# EAGLE design TF0060DCA (EAGLE 9.6.2)
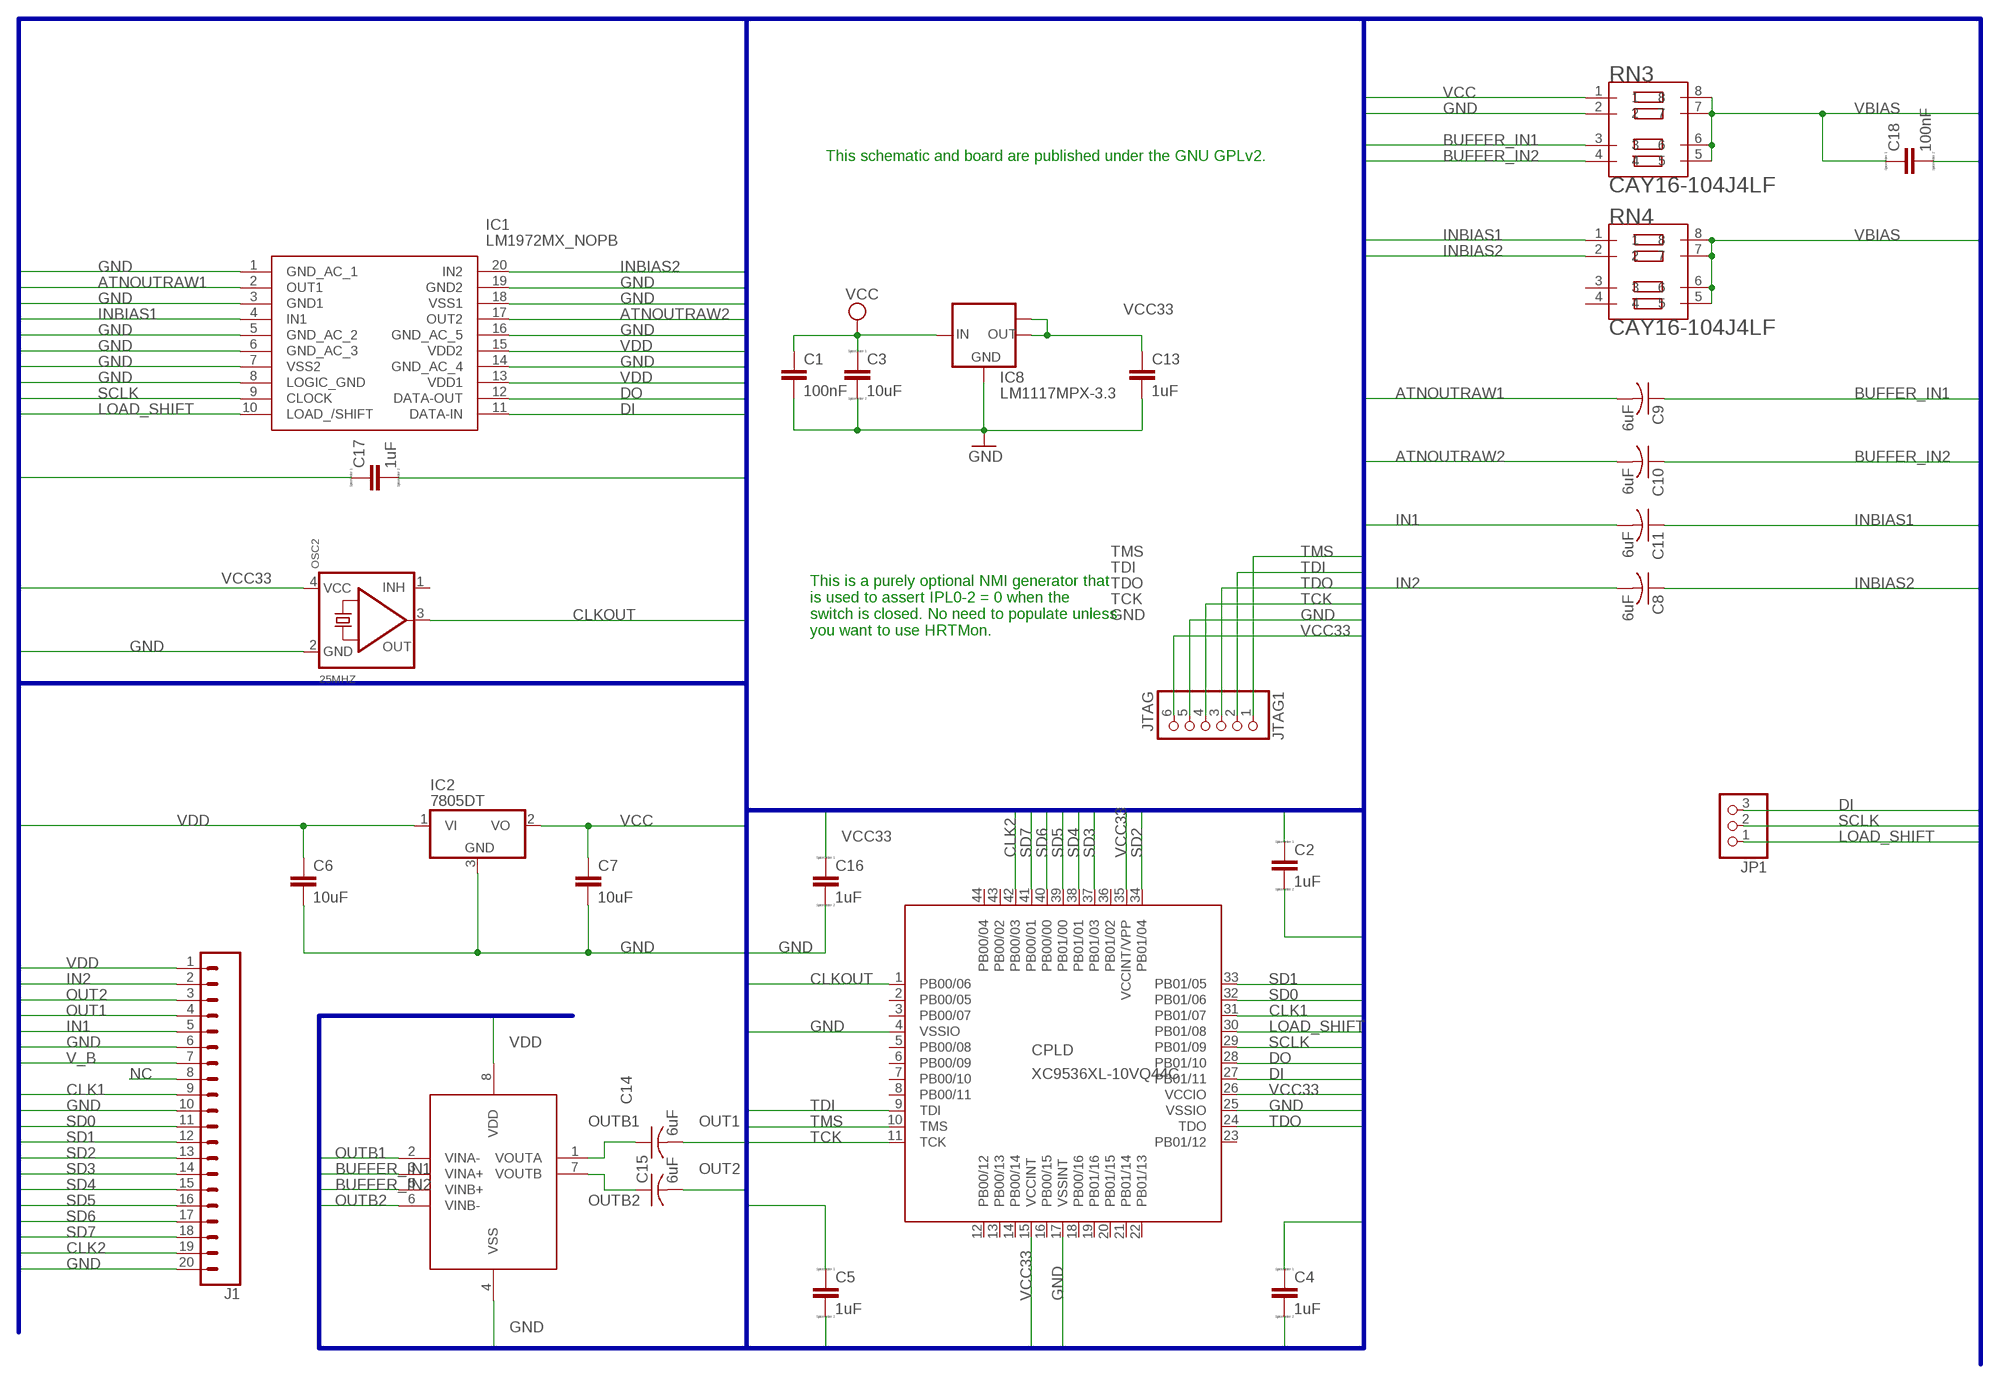
[diagram p0: schematic, sheet 1]

## Parts
C1  100nF  C-EUC1206  [C1206]
C2  1uF  CC0603  [C0603]
C3  10uF  CC0603  [C0603]
C4  1uF  CC0603  [C0603]
C5  1uF  CC0603  [C0603]
C6  10uF  C-EUC1206  [C1206]
C7  10uF  C-EUC1206  [C1206]
C8  6uF  C-USC0805  [C0805]
C9  6uF  C-USC0805  [C0805]
C10  6uF  C-USC0805  [C0805]
C11  6uF  C-USC0805  [C0805]
C13  1uF  C-EUC1206  [C1206]
C14  6uF  C-USC0805  [C0805]
C15  6uF  C-USC0805  [C0805]
C16  1uF  CC0603  [C0603]
C17  1uF  CC0603  [C0603]
C18  100nF  CC0603  [C0603]
CPLD  XC9536XL-10VQ44C  XC9536_44VQ  [SQFP-S-10X10-44]
IC1  LM1972MX_NOPB  [SOIC127P1030X265-20N]
IC2  7805DT  [TO252]
IC8  LM1117MPX-3.3  [SOT223]
IC12  MCP6002T-I_SN  [SOIC127P600X175-8N]
J1  CONN_20  [1X20]
JP1  PINHD-1X3  [1X03]
JTAG1  JTAG  HEADER-1X6ROUND  [1X06_ROUND]
OSC2  25MHZ  OSCILLATOR  [OSC_7X5MM]
RN3  CAY16-104J4LF  CAY16-103J4LF  [RESCAXE80P320X160-8N]
RN4  CAY16-104J4LF  CAY16-103J4LF  [RESCAXE80P320X160-8N]

## Nets
ATNOUTRAW1: C9.2 IC1.2(OUT1)
ATNOUTRAW2: C10.2 IC1.17(OUT2)
BUFFER_IN1: C9.1 IC12.3(VINA+) RN3.3
BUFFER_IN2: C10.1 IC12.5(VINB+) RN3.4
CLK1: CPLD.31(PB01/07) J1.9
CLK2: CPLD.42(PB00/03) J1.19
CLKOUT: CPLD.1(PB00/06) OSC2.3(OUT)
DI: CPLD.27(PB01/11) IC1.11(DATA-IN) JP1.3
DO: CPLD.28(PB01/10) IC1.12(DATA-OUT)
GND: C1.2 C2.2 C3.2 C4.2 C5.2 C6.2 C7.2 C13.2 C16.2 C17.2 C18.2 CPLD.4(VSSIO) CPLD.17(VSSINT) CPLD.25(VSSIO) IC1.1(GND_AC_1) IC1.3(GND1) IC1.5(GND_AC_2) IC1.6(GND_AC_3) IC1.7(VSS2) IC1.8(LOGIC_GND) IC1.14(GND_AC_4) IC1.16(GND_AC_5) IC1.18(VSS1) IC1.19(GND2) IC2.3(GND) IC8.1(GND) IC12.4(VSS) J1.6 J1.10 J1.20 JTAG1.5 OSC2.2(GND) RN3.2
IN1: C11.2 J1.5
IN2: C8.2 J1.2
INBIAS1: C11.1 IC1.4(IN1) RN4.1
INBIAS2: C8.1 IC1.20(IN2) RN4.2
LOAD_SHIFT: CPLD.30(PB01/08) IC1.10(LOAD_/SHIFT) JP1.1
NC: J1.8
OUT1: C14.2 J1.4
OUT2: C15.2 J1.3
OUTB1: C14.1 IC12.1(VOUTA) IC12.2(VINA-)
OUTB2: C15.1 IC12.6(VINB-) IC12.7(VOUTB)
SCLK: CPLD.29(PB01/09) IC1.9(CLOCK) JP1.2
SD0: CPLD.32(PB01/06) J1.11
SD1: CPLD.33(PB01/05) J1.12
SD2: CPLD.34(PB01/04) J1.13
SD3: CPLD.37(PB01/03) J1.14
SD4: CPLD.38(PB01/01) J1.15
SD5: CPLD.39(PB01/00) J1.16
SD6: CPLD.40(PB00/00) J1.17
SD7: CPLD.41(PB00/01) J1.18
TCK: CPLD.11(TCK) JTAG1.4
TDI: CPLD.9(TDI) JTAG1.2
TDO: CPLD.24(TDO) JTAG1.3
TMS: CPLD.10(TMS) JTAG1.1
V_B: J1.7
VBIAS: C18.1 RN3.5 RN3.6 RN3.7 RN3.8 RN4.5 RN4.6 RN4.7 RN4.8
VCC: C1.1 C3.1 C7.1 C17.1 IC2.2(VO) IC8.3(IN) RN3.1
VCC33: C2.1 C4.1 C5.1 C13.1 C16.1 CPLD.15(VCCINT) CPLD.26(VCCIO) CPLD.35(VCCINT/VPP) IC8.2(OUT) IC8.TAB(OUT1) JTAG1.6 OSC2.4(VCC)
VDD: C6.1 IC1.13(VDD1) IC1.15(VDD2) IC2.1(VI) IC12.8(VDD) J1.1
Unconnected: CPLD.2(PB00/05) CPLD.3(PB00/07) CPLD.5(PB00/08) CPLD.6(PB00/09) CPLD.7(PB00/10) CPLD.8(PB00/11) CPLD.12(PB00/12) CPLD.13(PB00/13) CPLD.14(PB00/14) CPLD.16(PB00/15) CPLD.18(PB00/16) CPLD.19(PB01/16) CPLD.20(PB01/15) CPLD.21(PB01/14) CPLD.22(PB01/13) CPLD.23(PB01/12) CPLD.36(PB01/02) CPLD.43(PB00/02) CPLD.44(PB00/04) OSC2.1(INH) RN4.3 RN4.4

## Buses
ATNOUTRAW[1..2],BUFFER_IN[1..2],CLK[1..2],CLKOUT,DI,DO,GND,IN[1..2],INBIAS[1..2],LOAD_SHIFT,OBUF[1..2],OUT[1..2],OUTB[1..2],SCLK,SD[0..7],TCK,TDI,TDO,TMS,V_B,VBIAS,VCC,VCC33,VDD

## Notes on the sheet
- This schematic and board are published under the GNU GPLv2.
- This is a purely optional NMI generator that 
  is used to assert IPL0-2 = 0 when the
  switch is closed. No need to populate unless
  you want to use HRTMon.

## Library data of the parts
C1 C6 C7 C13 = rcl:C-EU: CAPACITOR, European symbol; SPICEPREFIX: C
C2-C5 C16-C18 = eagle-ltspice:C: CAPACITOR, European symbol; SPICEMODEL: NONE; SPICEPREFIX: C
C8-C11 C14 C15 = rcl:C-US: CAPACITOR, American symbol; SPICEPREFIX: C
CPLD = xilinx-xc9:XC9536_44VQ: xc9536_pc44 XC9500 In-System Programmable CPLD Family Auto generated by make-symbol-device-package-bsdl.ulp Rev. 34 Source: xc9536_vq44.bsd; MPN: XC9536-15VQG44C; OC_FARNELL: 1193227; OC_NEWARK: 98K3377
IC1 = SamacSys_Parts:LM1972MX_NOPB: Micro-Pot 2-Channel 78 dB Audio Attenuator with Mute Source: Datasheet <http://www.ti.com/lit/gpn/LM1972>; DESCRIPTION: Micro-Pot 2-Channel 78 dB Audio Attenuator with Mute; HEIGHT: 2.65mm; MANUFACTURER_NAME: Texas Instruments; MANUFACTURER_PART_NUMBER: LM1972MX/NOPB; MOUSER_PART_NUMBER: 926-LM1972MX/NOPB; MOUSER_PRICE-STOCK: https://www.mouser.co.uk/ProductDetail/Texas-Instruments/LM1972MX-NOPB?qs=X1J7HmVL2ZH04ksznhxyxw%3D%3D
IC2 = linear:78*: Positive VOLTAGE REGULATOR Source: http://cache.national.com/ds/LM/LM78L05.pdf http://www.fairchildsemi.com/ds/LM/LM7805.pdf
IC8 = lm1117:LM1117MPX-*
IC12 = MCP6002T-I_SN:MCP6002T-I_SN: Op. Amplifier Dual 1MHz Low-Power SOIC8 Microchip MCP6002T-I/SN, Dual Low Power Op Amp, 1MHz Rail-Rail, 1.8 6 V, 8-Pin SOIC Source: Datasheet <http://uk.rs-online.com/web/p/products/8234276P>; ALLIED_NUMBER: 70451327; DESCRIPTION: Op. Amplifier Dual 1MHz Low-Power SOIC8 Microchip MCP6002T-I/SN, Dual Low Power Op Amp, 1MHz Rail-Rail, 1.8 6 V, 8-Pin SOIC; HEIGHT: 1.75mm; MANUFACTURER_NAME: Microchip; MANUFACTURER_PART_NUMBER: MCP6002T-I/SN; RS_PART_NUMBER: 8234276P; RS_PRICE-STOCK: http://uk.rs-online.com/web/p/products/8234276P
J1 = SparkFun-Connectors:CONN_20: Multi connection point. Often used as Generic Header-pin footprint for 0.1 inch spaced/style header connections On any of the 0.1 inch spaced packages, you can populate with these: Break Away Headers - Straight <https://www.sparkfun.com/products/116> (PRT-00116) Break Away Male Headers - Right Angle <https://www.sparkfun.com/products/553> (PRT-00553) Female Headers <https://www.sparkfun.com/products/115> (PRT-00115) Break Away Headers - Machine Pin <https://www.sparkfun.com/products/117> (PRT-00117) Break Away Female Headers - Swiss Machine Pin <https://www.sparkfun.com/products/743> (PRT-00743) For SCREWTERMINALS and SPRING TERMINALS visit here: Screw Terimnals on SparkFun.com <https://www.sparkfun.com/search/results?term=Screw+Terminals> (5mm/3.5mm/2.54mm spacing) This device is also useful as a general connection point to wire up your design to another part of your project. Our various solder wires solder well into these plated through hole pads. Hook-Up Wire - Assortment (Stranded, 22 AWG) <https://www.sparkfun.com/products/11375> (PRT-11375) Hook-Up Wire - Assortment (Solid Core, 22 AWG) <https://www.sparkfun.com/products/11367> (PRT-11367) View the entire wire category on our website here <https://www.sparkfun.com/categories/141> Special notes: Molex polarized connector foot print use with SKU : PRT-08231 with associated crimp pins and housings. 1MM SMD Version SKU: PRT-10208 NOTES ON THE VARIANTS LOCK and LOCK_LONGPADS... This footprint was designed to help hold the alignment of a through-hole component (i.e. 6-pin header) while soldering it into place. You may notice that each hole has been shifted either up or down by 0.005 of an inch from it's more standard position (which is a perfectly straight line). This slight alteration caused the pins (the squares in the middle) to touch the edges of the holes. Because they are alternating, it causes a "brace" to hold the component in place. 0.005 has proven to be the perfect amount of "off-center" position when using our standard breakaway headers. Although looks a little odd when you look at the bare footprint, once you have a header in there, the alteration is very hard to notice. Also,if you push a header all the way into place, it is covered up entirely on the bottom side. Note about LOCK SPECIAL package: This is just like the LOCK variant in that the holes are staggared by 5 mil, but except for the last two holes. They are not altered from the "standard" footprint layout. This is used for a special purpose on the layout of our Graphic LCD Backpack. Make sure you want to use this device before selecting it for you project!
JP1 = adafruit:PINHD-1X3: PIN HEADER
JTAG1 = microbuilder:HEADER-1X6: PIN HEADER
OSC2 = microbuilder:OSCILLATOR: Oscillators 3.2x2.5mm SMT 4.0MHz +/- 50ppm, 3.3V, 9mA, -40/+85°C - Digikey: 535-9752-1-ND 50MHz +/- 50ppm, 3.3V, 8mA, -10/+70°C - Digikey: 478-4792-1-ND 5x7mm SMT 4.0MHz +/-20ppm 3.3V, 20mA, -20/+70°C - Digikey: 535-9329-2-ND 50MHz +/- 25ppm 3.3V, 35mA, -40/+85°C - Digikey: 631-1197-1-ND
RN3 RN4 = CAY16-103J4LF:CAY16-103J4LF: Res Thick Film Array 10K Ohm 5% 200ppm/C ISOL Molded 8-Pin 1206(4 X 0603) Convex SMD Paper T/R; AVAILABILITY: Good; DESCRIPTION: Res Thick Film Array 10K Ohm 5% ?200ppm/C ISOL Molded 8-Pin 1206(4 X 0603) Convex SMD Paper T/R; MF: Bourns; MP: CAY16-103J4LF; PACKAGE: 1206 Bourns; PRICE: 0.02 USD

## Board
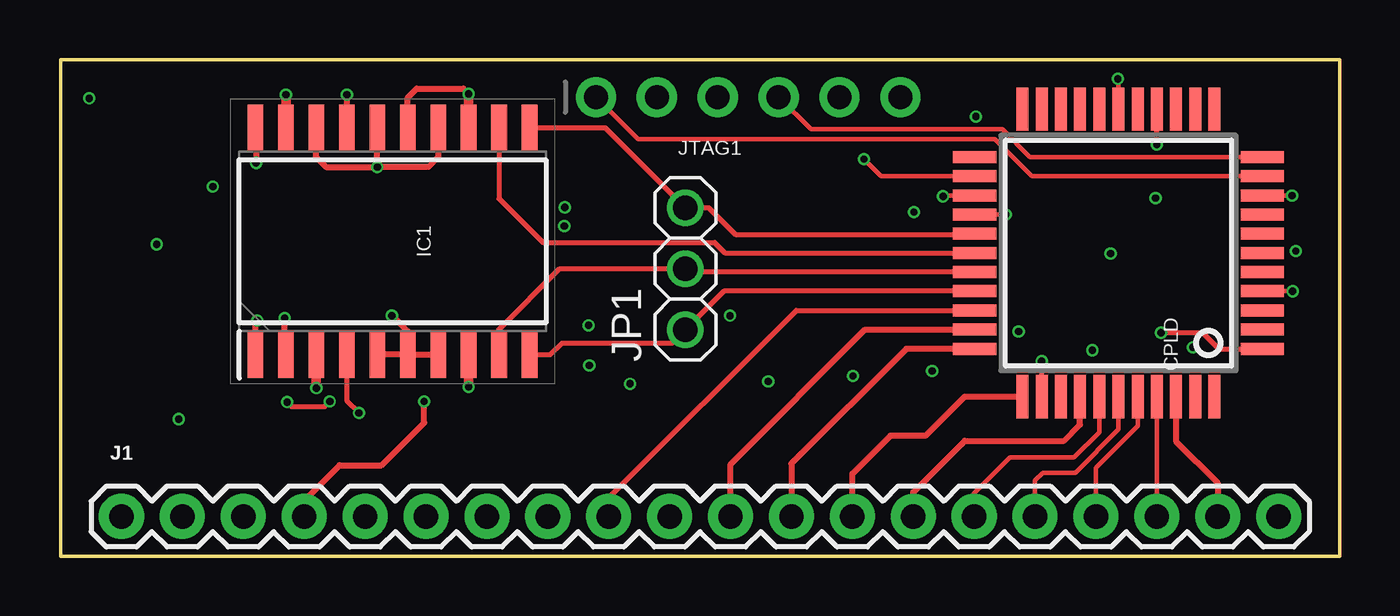
[diagram p1: board, top side]
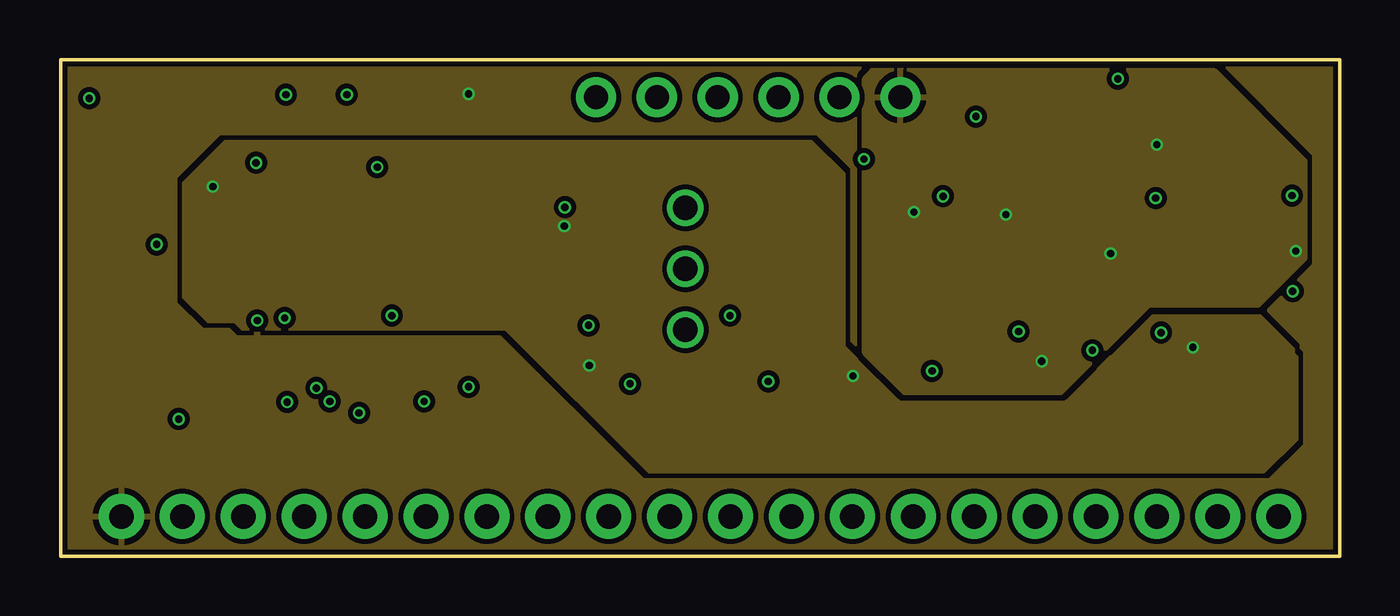
[diagram p2: board, inner layer PWR]
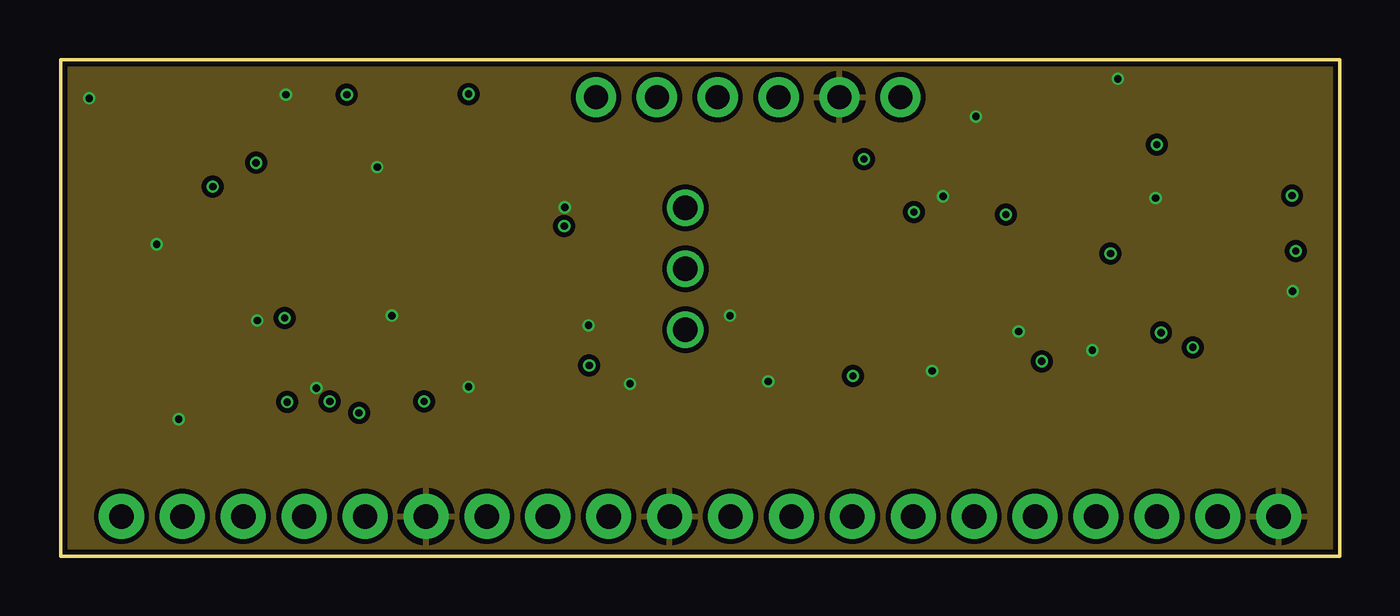
[diagram p3: board, inner layer GND]
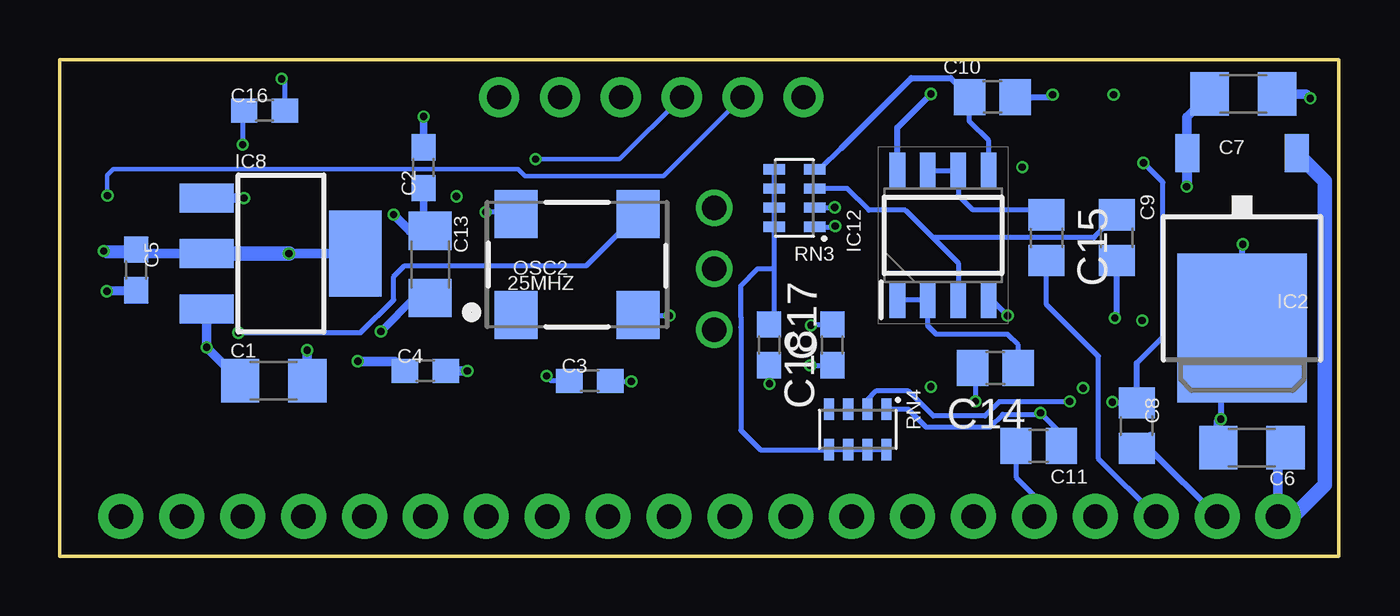
[diagram p4: board, bottom side, seen from below]

Size 53.34 x 20.7 mm. Coordinates in mm from the lower left corner, seen from the top.
Outline: 0,0 0,20.7 53.34,20.7 53.34,0 0,0
Copper layers (1*2*15*16): Top 0.035559375mm / dielectric 0.17018125mm / PWR 0.01778125mm / dielectric 47mil / GND 0.01778125mm / dielectric 0.17018125mm / Bottom 0.035559375mm
Design rules "jlcpcb-4-layer (1) *": minimum track width 5mil, minimum drill 0.2mm, track to track 0.126490625mm, track to pad 0.126490625mm, pad to pad 0.126490625mm, via to via 0.126490625mm, smd to smd 0mil, copper to edge 0.1mm, drill to drill 5mil, minimum pad ring 4mil, minimum via ring 4mil, stop-mask expansion 3mil, vias tented up to drill 100mil, thermal gap 10mil

### Footprints (pad centres in the part's own frame; a part is rotated, then mirrored left to right if it is on the bottom)
C1206 = smd 1.6 x 1.8: 1 -1.4,0; 2 1.4,0
C0603 = smd 1.1 x 1: 1 -0.85,0; 2 0.85,0
C0805 = smd 1.3 x 1.5: 1 -0.95,0; 2 0.95,0
SQFP-S-10X10-44 = smd 0.5 x 1.8: 1 -4,-6; 2 -3.2,-6; 3 -2.4,-6; 4 -1.6,-6; 5 -0.8,-6; 6 0,-6; 7 0.8,-6; 8 1.6,-6; 9 2.4,-6; 10 3.2,-6; 11 4,-6; 23 4,6; 24 3.2,6; 25 2.4,6; 26 1.6,6; 27 0.8,6; 28 0,6; 29 -0.8,6; 30 -1.6,6; 31 -2.4,6; 32 -3.2,6; 33 -4,6 | smd 1.8 x 0.5: 12 6,-4; 13 6,-3.2; 14 6,-2.4; 15 6,-1.6; 16 6,-0.8; 17 6,0; 18 6,0.8; 19 6,1.6; 20 6,2.4; 21 6,3.2; 22 6,4; 34 -6,4; 35 -6,3.2; 36 -6,2.4; 37 -6,1.6; 38 -6,0.8; 39 -6,0; 40 -6,-0.8; 41 -6,-1.6; 42 -6,-2.4; 43 -6,-3.2; 44 -6,-4
SOIC127P1030X265-20N = smd 1.95 x 0.65: 1 -4.725,5.715; 2 -4.725,4.445; 3 -4.725,3.175; 4 -4.725,1.905; 5 -4.725,0.635; 6 -4.725,-0.635; 7 -4.725,-1.905; 8 -4.725,-3.175; 9 -4.725,-4.445; 10 -4.725,-5.715; 11 4.725,-5.715; 12 4.725,-4.445; 13 4.725,-3.175; 14 4.725,-1.905; 15 4.725,-0.635; 16 4.725,0.635; 17 4.725,1.905; 18 4.725,3.175; 19 4.725,4.445; 20 4.725,5.715
TO252 = smd 1 x 1.6: 1 -2.28,-4.8; 2 2.28,-4.8 | smd 5.4 x 6.2: 3 0,2.5
SOT223 = smd 1.219 x 2.235: 1 -2.311,-3.099; 2 0,-3.099; 3 2.311,-3.099 | smd 3.6 x 2.2: TAB 0,3.099
SOIC127P600X175-8N = smd 1.5 x 0.65: 1 -2.7,1.905; 2 -2.7,0.635; 3 -2.7,-0.635; 4 -2.7,-1.905; 5 2.7,-1.905; 6 2.7,-0.635; 7 2.7,0.635; 8 2.7,1.905
1X20 = drill 1.016 pad 1.88: 1 0,0; 2 2.54,0; 3 5.08,0; 4 7.62,0; 5 10.16,0; 6 12.7,0; 7 15.24,0; 8 17.78,0; 9 20.32,0; 10 22.86,0; 11 25.4,0; 12 27.94,0; 13 30.48,0; 14 33.02,0; 15 35.56,0; 16 38.1,0; 17 40.64,0; 18 43.18,0; 19 45.72,0; 20 48.26,0
1X03 = drill 1.016: 1 -2.54,0; 2 0,0; 3 2.54,0
1X06_ROUND = drill 1 pad 1.676: 1 -6.35,0; 2 -3.81,0; 3 -1.27,0; 4 1.27,0; 5 3.81,0; 6 6.35,0
OSC_7X5MM = smd 1.8 x 2: 1 -2.54,-2.1; 2 2.54,-2.1; 3 2.54,2.1; 4 -2.54,2.1
RESCAXE80P320X160-8N = smd 0.9 x 0.425: 1 -0.85,1.2; 2 -0.85,0.4; 3 -0.85,-0.4; 4 -0.85,-1.2; 5 0.85,-1.2; 6 0.85,-0.4; 7 0.85,0.4; 8 0.85,1.2

### Placement (x,y rotation side)
C1  44.42,7.32 0 bottom
C2  38.18,16.21 90 bottom
C3  31.24,7.32 0 bottom
C4  38.1,7.72 0 bottom
C5  50.16,11.94 270 bottom
C6  3.63,4.52 180 bottom
C7  3.99,19.28 0 bottom
C8  8.43,5.44 270 bottom
C9  9.27,13.28 270 bottom
C10  14.45,19.15 0 bottom
C11  12.52,4.6 180 bottom
C13  37.9,12.17 270 bottom
C14  14.33,7.85 180 bottom
C15  12.19,13.28 270 bottom
C16  44.81,18.59 0 bottom
C17  21.13,8.81 90 bottom
C18  23.77,8.81 270 bottom
CPLD  44.12,12.65 90 top
IC1  13.84,13.13 90 top
IC2  4.04,12.01 180 bottom
IC8  44.12,12.62 270 bottom
IC12  16.51,13.39 90 bottom
J1  2.54,1.65 0 top
JP1  26.06,11.99 90 top
JTAG1  28.68,19.15 0 top
OSC2  31.78,12.17 0 bottom
RN3  22.71,14.94 180 bottom
RN4  20.07,5.28 270 bottom

### Tracks (layer width: path | path; a pad name or v marks a point on that pad's centre or on a via)
ATNOUTRAW1  (via drill 0.3)
  Top 0.254: IC1.2 9.35,8.46 v9.35,9.93
  Bottom 0.254: v9.35,9.93 9.27,10.01 C9.2
ATNOUTRAW2  (via drill 0.3)
  Top 0.254: v11.94,19.25 IC1.17
  Bottom 0.254: C10.2 12.04,19.15 v11.94,19.25
BUFFER_IN1
  Bottom 0.203: IC12.3 15.88,12.22 16.94,13.28 | 16.94,13.28 18.09,14.43 19.61,14.43 20.52,15.34 RN3.3 | C9.1 10.22,13.28 16.94,13.28
BUFFER_IN2
  Bottom 0.203: IC12.5 14.61,17.32 15.4,18.12 C10.1 | 20.76,17.01 21.64,16.14 RN3.4
  Bottom 0.254: 20.76,17.01 17.83,19.94 16.19,19.94 C10.1
CLK1
  Top 0.203: CPLD.31 30.68,10.25 22.86,2.43 J1.9
CLK2
  Top 0.254: CPLD.42 46.52,4.79 48.26,3.05 J1.19
CLKOUT  (via drill 0.3)
  Top 0.203: CPLD.1 48.3,8.65 47.62,9.32 v45.9,9.32
  Bottom 0.203: OSC2.3 31.39,12.12 38.96,12.12 39.42,11.66 39.42,10.69 40.79,9.32 v45.9,9.32
DI
  Top 0.203: CPLD.27 38.07,13.4 28.17,13.4 27.04,14.53 JP1.3 22.73,17.86 IC1.11
DO
  Top 0.203: IC1.12 18.29,14.91 20.12,13.08 27.28,13.08 27.71,12.65 CPLD.28
GND  (via drill 0.3)
  Top 0.178: CPLD.17 44.12,19.89 v44.09,19.91 | CPLD.4 v51.38,11.05 | v51.38,11.05 | CPLD.25 36.84,15.05 v36.8,15.01
  Top 0.203: 13.31,16.33 v13.21,16.23
  Top 0.254: IC1.6 IC1.7 | IC1.6 IC1.5 | IC1.6 14.48,9.37 v13.82,10.03 | IC1.1 8.13,9.75 v8.2,9.83 | IC1.14 15.75,16.64 15.34,16.23 13.41,16.23 | IC1.16 13.21,16.43 13.31,16.33 13.41,16.23 | 13.41,16.23 v13.21,16.23 11.07,16.23 10.67,16.64 IC1.18
  Top 0.406: IC1.19 v9.4,19.25 | IC1.8 v17.02,7.06 | IC1.3 v10.67,7.01
  Bottom 0.203: C3.2 30.37,7.29 v29.52,7.29 | OSC2.2 29.2,10.03 v27.91,10.03 | C16.2 43.96,19.78 v44.09,19.91 | RN3.2 21.05,14.54 v21.03,14.55 | IC12.4 14.47,10.69 v13.82,10.03 | C18.2 23.77,7.21 v23.75,7.19 | v22.02,9.63 21.98,9.66 C17.2
  Bottom 0.254: v4.93,5.71 4.93,8.62 IC2.3 4.04,12.98 v4.01,13.01
  Bottom 0.305: C2.2 v38.18,18.34 | C13.2 38.56,10.77 v39.95,9.37
  Bottom 0.406: C1.2 v43.02,8.58 v43.03,8.59 | C5.2 51.27,11.05 v51.38,11.05 | C4.2 v36.35,7.72 | IC8.1 v45.67,14.94 | C7.2 1.37,19.28 v1.19,19.1 | v4.93,5.71 5.03,5.61 C6.2
  pour GND (isolate 0.203, rank 2): 0,20.7 0,0 53.34,0 53.34,20.7
IN1
  Bottom 0.203: J1.5 12.7,2.51 13.47,3.28 C11.2
IN2
  Bottom 0.254: C8.2 7.86,5.06 7.86,4.43 J1.2
INBIAS1  (via drill 0.3)
  Top 0.203: IC1.4 11.94,6.48 v12.45,5.97
  Bottom 0.203: C11.1 11.57,5.09 v12.45,5.97 12.5,5.92 14.02,5.92 14.55,5.38 17.22,5.38 17.97,6.13 RN4.1
INBIAS2  (via drill 0.3)
  Top 0.203: v9.45,6.43 9.65,6.22 11,6.22 v11.23,6.45
  Top 0.254: IC1.20 8.15,17.83 v8.15,16.41
  Bottom 0.203: 8.43,8.05 7.34,9.14 7.34,15.6 v8.15,16.41 | RN4.2 19.67,6.52 19.28,6.91 17.98,6.91 16.92,5.84 14.76,5.84 14.15,6.45 v11.23,6.45 | v9.45,6.43 9.41,6.39 C8.1
  Bottom 0.254: C8.1 8.43,8.05
LOAD_SHIFT
  Top 0.203: CPLD.30 27.66,11.05 JP1.1 25.5,8.89 20.9,8.89 20.42,8.41 IC1.10
OUT1  (via drill 0.3)
  Top 0.254: J1.4 10.16,2.31 11.63,3.79 13.39,3.79 15.16,5.56 v15.16,6.45
  Bottom 0.203: C14.2 15.16,7.74 v15.16,6.45
OUT2
  Bottom 0.203: C15.2 12.19,10.49 10.03,8.33 10.03,4.06 J1.3
OUTB1
  Bottom 0.203: IC12.1 IC12.2 17.14,9.6 16.79,9.25 13.82,9.25 13.38,8.8 C14.1
OUTB2
  Bottom 0.203: IC12.7 IC12.6 15.88,15.05 15.29,14.46 12.42,14.46 C15.1
SCLK
  Top 0.203: IC1.9 18.29,9.46 20.82,11.99 JP1.2 26.2,11.85 CPLD.29
SD0
  Top 0.254: CPLD.32 33.55,9.45 27.94,3.83 J1.11
SD1
  Top 0.254: J1.12 30.48,3.86 35.27,8.65 CPLD.33
SD2
  Top 0.254: J1.13 33.02,3.44 34.6,5.02 36.08,5.02 37.7,6.65 CPLD.34
SD3
  Top 0.254: J1.14 35.56,2.67 37.71,4.81 41.85,4.81 42.52,5.49 CPLD.37
SD4
  Top 0.178: J1.15 38.1,2.62 39.6,4.11 42.27,4.11 43.32,5.17 CPLD.38
SD5
  Top 0.178: J1.16 40.64,3.15 40.97,3.48 42.32,3.48 44.12,5.28 CPLD.39
SD6
  Top 0.178: J1.17 43.18,3.68 44.92,5.42 CPLD.40
SD7
  Top 0.178: 45.72,3.68 J1.18 | CPLD.41 45.72,3.68 | 45.72,3.68
TCK
  Top 0.178: JTAG1.4 31.29,17.8 39.28,17.8 40.43,16.65 CPLD.11
TDI  (via drill 0.3)
  Top 0.178: v51.36,15.04 50.13,15.04 CPLD.9
  Bottom 0.178: JTAG1.2 28.17,15.85 33.93,15.85 34.23,16.15 51.11,16.15 51.36,15.9 v51.36,15.04
TDO  (via drill 0.3)
  Top 0.178: v33.5,16.56 34.21,15.85 CPLD.24
  Bottom 0.178: JTAG1.3 30,16.56 v33.5,16.56
TMS
  Top 0.178: CPLD.10 40.51,15.85 38.96,17.4 24.08,17.4 JTAG1.1
VBIAS
  Bottom 0.203: RN3.5 RN3.6 RN3.7 RN3.8 23.56,11.99 | RN4.8 RN4.7 RN4.6 RN4.5 24.13,4.43 24.94,5.25 24.94,9.55 24.94,9.99 24.94,11.28 24.23,11.99 23.56,11.99 | 23.56,11.99 23.56,10.79 23.56,9.88 C18.1
VCC  (via drill 0.3)
  Bottom 0.203: C3.1 32.84,7.32 v33.05,7.52 | RN3.1 21.04,13.74 v21.01,13.77 | v22.05,7.95 21.15,7.95 C17.1
  Bottom 0.406: C1.1 v47.22,8.71 IC8.3 | IC2.2 6.32,15.39 v6.34,15.41 | v6.34,15.41 v6.35,15.42 | C7.1 6.34,18.32 v6.34,15.41
  pour PWR (isolate 0.203, rank 2): 5.13,10.79 5.13,15.57 6.86,17.3 31.32,17.3 32.66,15.95 32.66,8.74 35,6.4 41.88,6.4 45.49,10.01 50.04,10.01 51.41,8.64 51.41,8.46 51.56,8.31 51.56,4.88 50.19,3.51 24.54,3.51 18.57,9.47 7.57,9.47 7.26,9.78 6.15,9.78
VCC33  (via drill 0.3)
  Top 0.178: CPLD.26 v39.42,14.25 | v39.42,14.25
  Top 0.203: CPLD.35 v40.92,8.13 | v45.72,17.17 | v45.72,17.17 CPLD.15
  Bottom 0.203: C16.1 45.72,18.53 v45.72,17.17 | OSC2.4 34.4,14.35 v35.59,14.35
  Bottom 0.305: C2.1 38.18,13.85 C13.1
  Bottom 0.406: v39.42,14.25 38.74,13.57 C13.1 | v43.79,12.62 IC8.TAB | C5.1 50.18,12.77 51.46,12.78 v51.51,12.73 51.41,12.62 IC8.2 | C4.1 39.36,8.13 v40.92,8.13
  Bottom 0.61: IC8.2 v43.79,12.62
  pour PWR (isolate 0.203): 33.83,20.27 48.11,20.27 51.89,16.48 51.89,12.42 49.94,10.46 45.36,10.46 41.71,6.81 35.2,6.81 33.53,8.48 33.53,19.91 33.86,20.24
VDD  (via drill 0.3)
  Top 0.254: IC1.15 14.48,19.13 14.86,19.51 16.79,19.51 v17.02,19.28
  Top 0.406: IC1.13 v17.02,19.28
  Bottom 0.254: IC12.8 18.41,17.88 v17.02,19.28
  Bottom 0.406: J1.1 2.54,4.21 C6.1
  Bottom 0.61: J1.1 1.91,1.65 0.58,2.97 0.58,15.64 IC2.1
  pour PWR (isolate 0.203, rank 3): 0,20.7 0,0 53.34,-0.13 53.34,20.7